# EasyEDA schematic SCH_BusyCube_2022-06-02.json
TITLE: RGB_BusyBox; REV: 1.0; Date: 2022-01-18; Sheet: 1/1; Company: Your Company
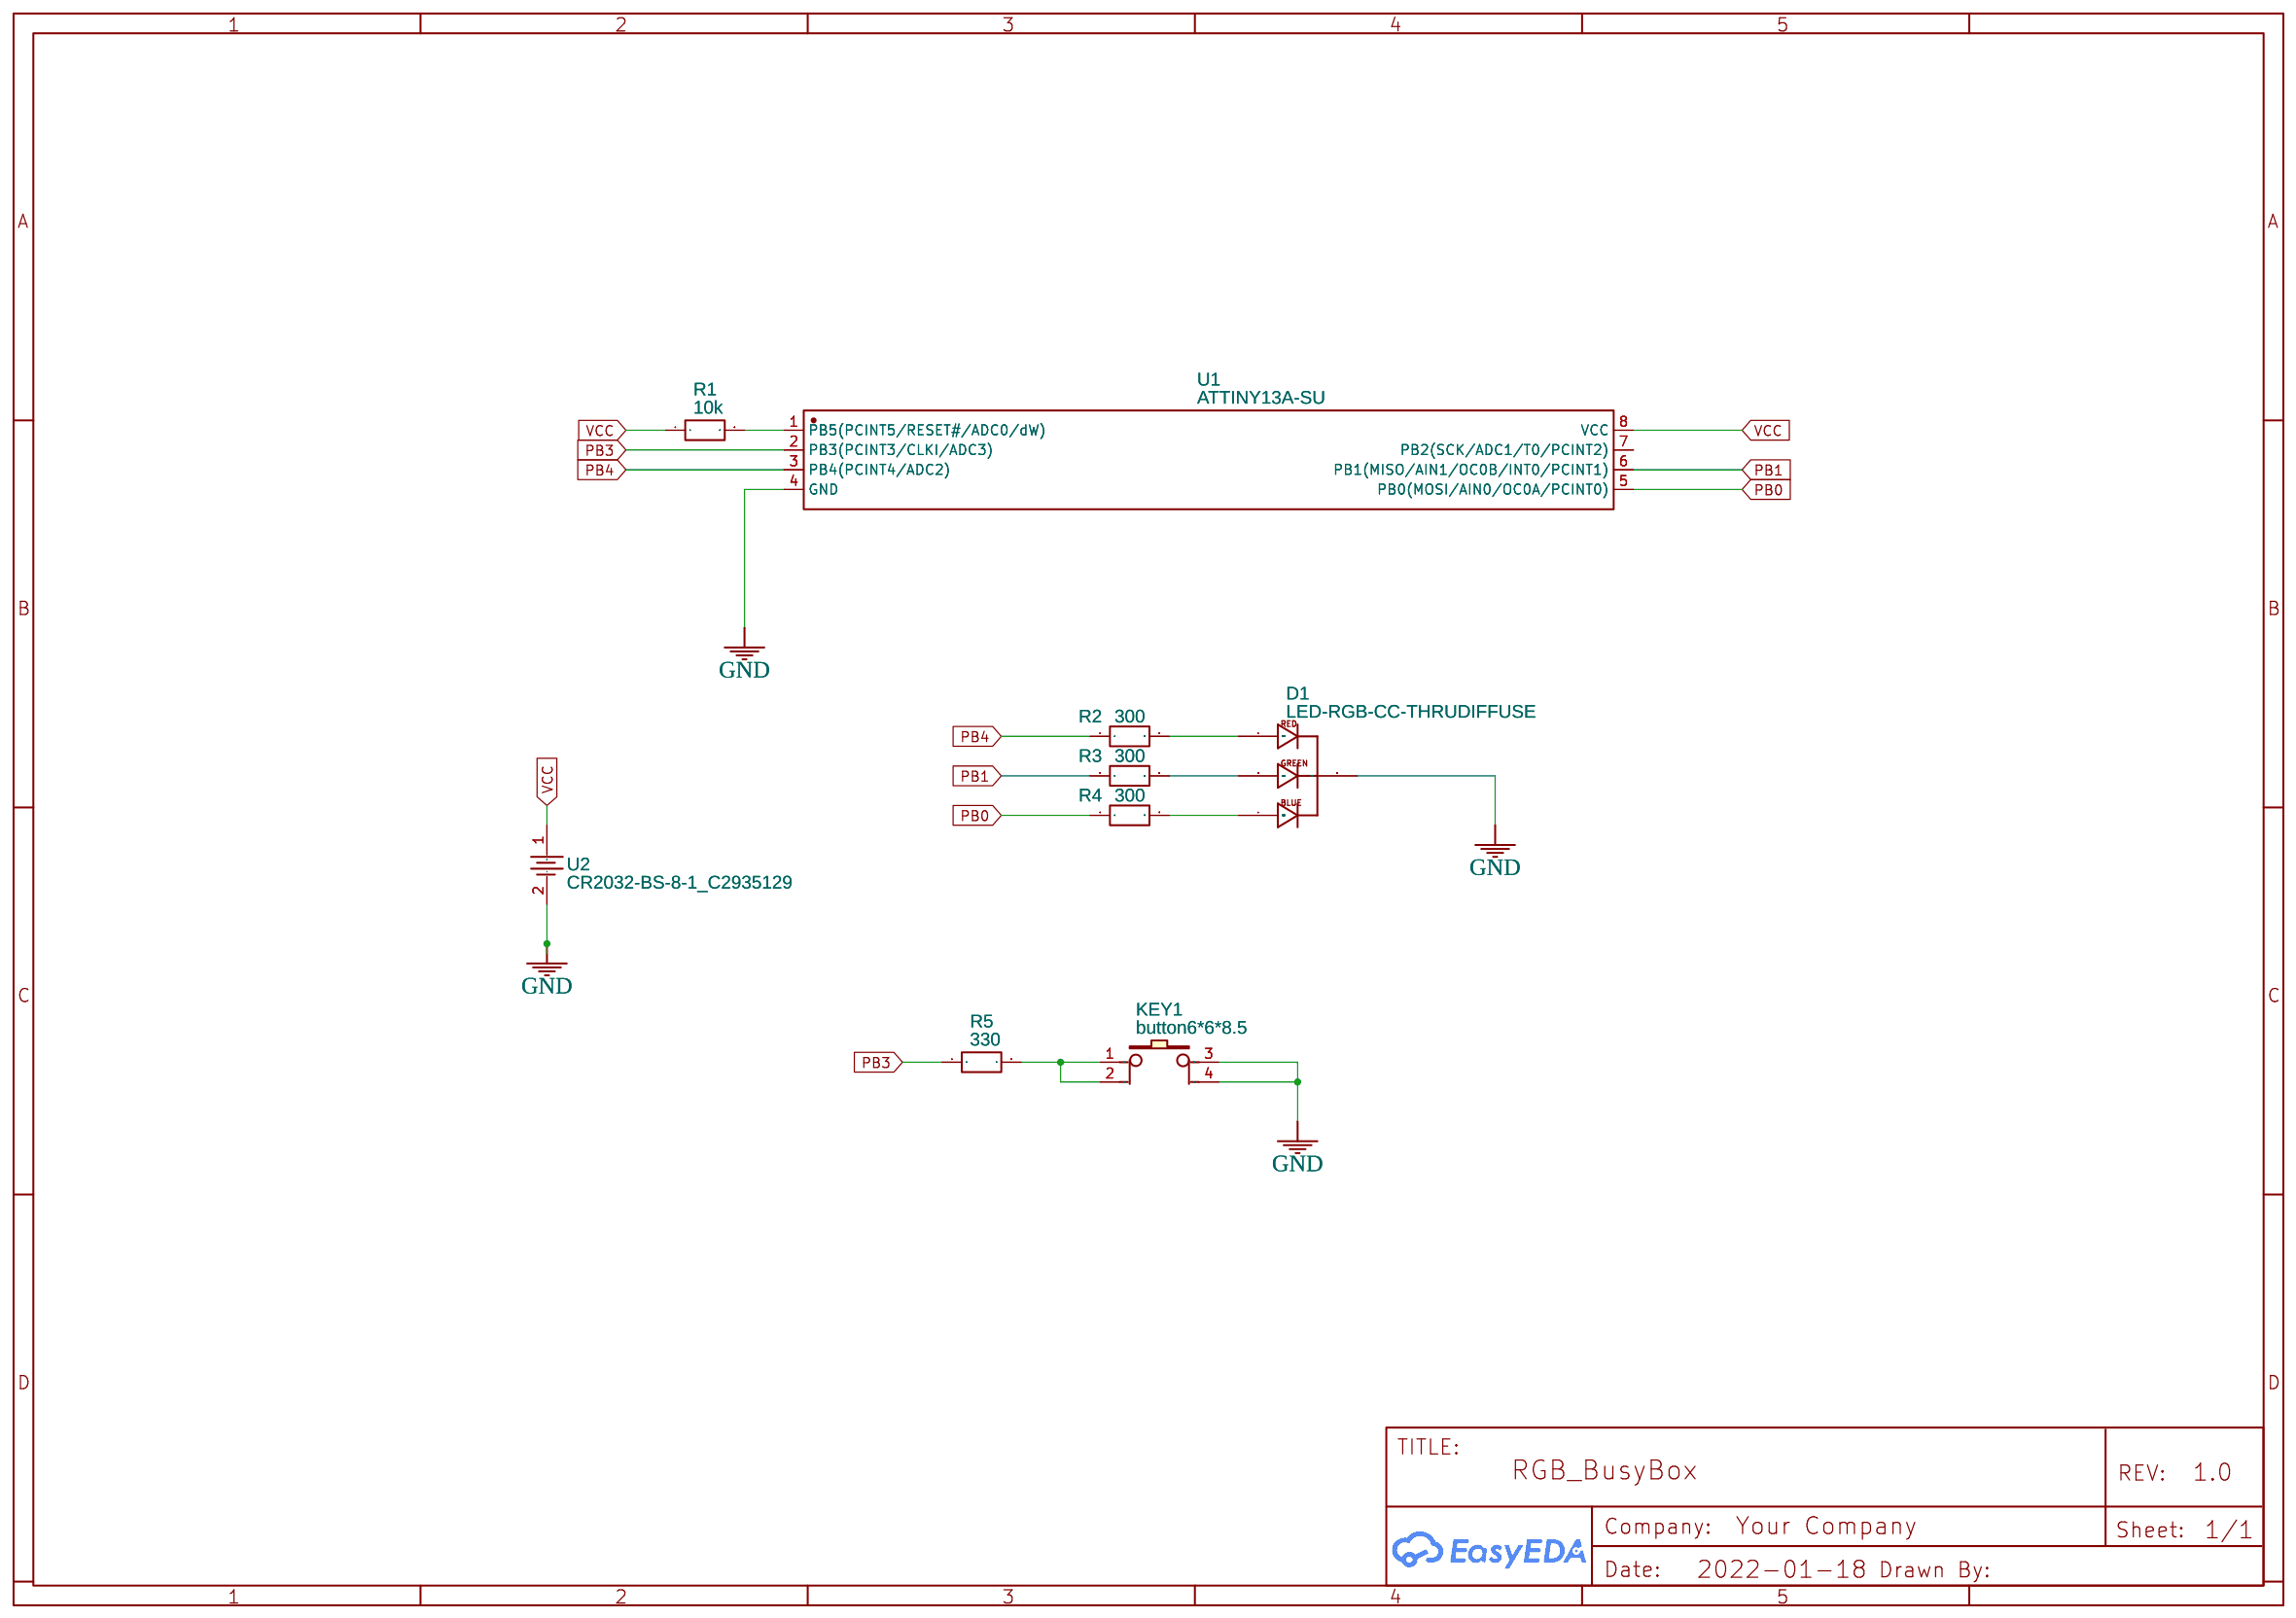
[diagram p0: schematic sheet]

## Parts
D1  LED-RGB-CC-THRUDIFFUSE  [LED-RGB-THRU]
KEY1  button6*6*8.5  [KEY-TH_4P-L6.0-W6.0-P4.50]
R1  10k  [R0603]
R2  300  [R0603]
R3  300  [R0603]
R4  300  [R0603]
R5  330  [R0603]
U1  ATTINY13A-SU  [SOIC-8_L5.3-W5.3-P1.27-LS8.0-BL]
U2  CR2032-BS-8-1_C2935129  [BAT-SMD_CR2032-BS-8-1]

## Library data of the parts
D1 = LED-RGB-CC-THRUDIFFUSE: RGB Through-hole common cathode LED; Contributor: SparkFun
KEY1 = button6*6*8.5: Supplier Part: C59980; Supplier: LCSC; Manufacturer: ReliaPro
R1-R5 = R_0603_EU: Contributor: LCEDA_Lib
U1 = ATTINY13A-SU: Supplier: LCSC; Manufacturer: MICROCHIP; Supplier Part: C9805; JLCPCB Part Class: Extended Part
U2 = CR2032-BS-8-1_C2935129: Supplier: LCSC; Supplier Part: C2935129; Manufacturer: null; Manufacturer Part: CR2032-BS-8-1; Contributor: LCSC

## Nets
GND: D1.2(CATHODE) KEY1.3 KEY1.4 U1.4(GND) U2.2(-)
VCC: R1.1 U1.8(VCC) U2.1(+)
PB0: R4.1 U1.5(PB0(MOSI/AIN0/OC0A/PCINT0))
PB1: R3.1 U1.6(PB1(MISO/AIN1/OC0B/INT0/PCINT1))
PB3: R5.1 U1.2(PB3(PCINT3/CLKI/ADC3))
PB4: R2.1 U1.3(PB4(PCINT4/ADC2))
Net-(D1-1): D1.1(RED_CATHODE) R2.2
Net-(D1-3): D1.3(GREEN_CATHODE) R3.2
Net-(D1-4): D1.4(BLUE_CATHODE) R4.2
Net-(KEY1-1): KEY1.1 KEY1.2 R5.2
Net-(R1-2): R1.2 U1.1(PB5(PCINT5/RESET#/ADC0/dW))

Not connected (* = marked no-connect by the designer): U1 7(PB2(SCK/ADC1/T0/PCINT2))
